# EAGLE design pulseoxintegr (EAGLE 6.5.0)
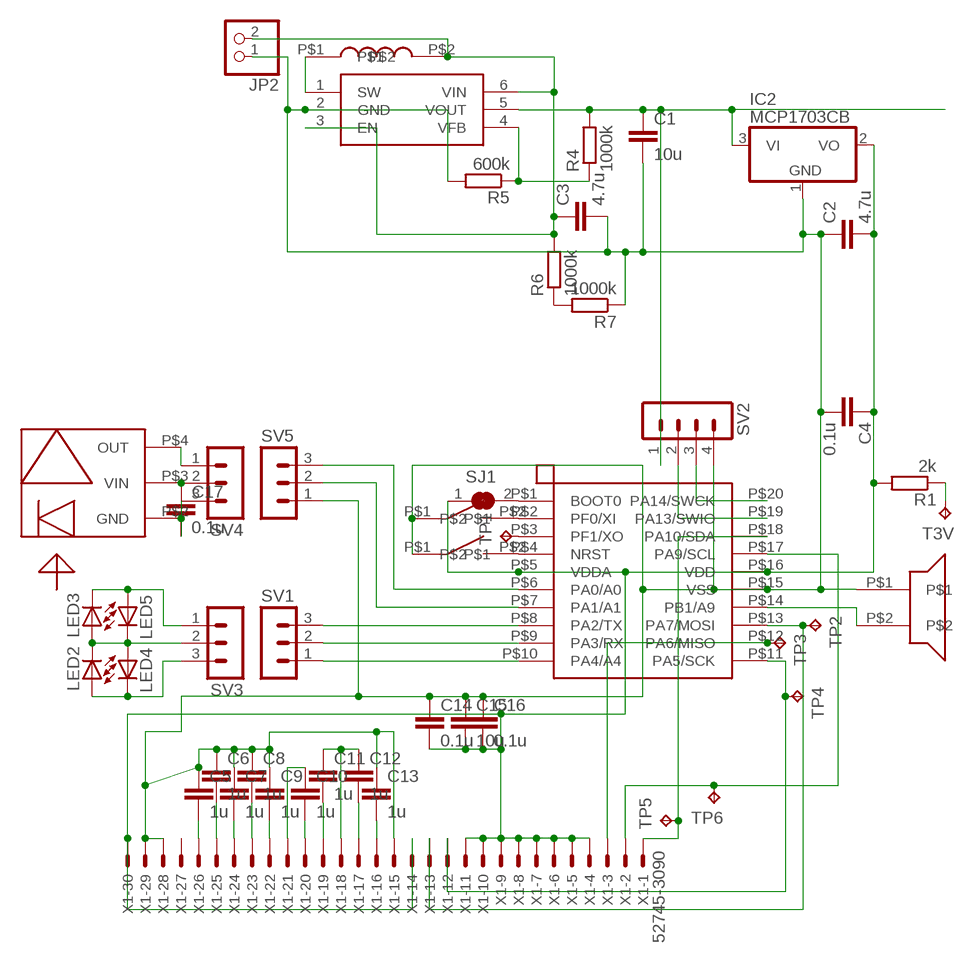
[diagram p0: schematic, sheet 1]

## Parts
C1  10u  C-EUC0603K  [C0603K]
C2  4.7u  C-EUC0603K  [C0603K]
C3  4.7u  C-EUC0603K  [C0603K]
C4  0.1u  C-EUC0603K  [C0603K]
C5  1u  C-EUC0603K  [C0603K]
C6  1u  C-EUC0603K  [C0603K]
C7  1u  C-EUC0603K  [C0603K]
C8  1u  C-EUC0603K  [C0603K]
C9  1u  C-EUC0603K  [C0603K]
C10  1u  C-EUC0603K  [C0603K]
C11  1u  C-EUC0603K  [C0603K]
C12  1u  C-EUC0603K  [C0603K]
C13  1u  C-EUC0603K  [C0603K]
C14  0.1u  C-EUC0603K  [C0603K]
C15  10u  C-EUC0603K  [C0603K]
C16  0.1u  C-EUC0603K  [C0603K]
C17  0.1u  C-EUC0603K  [C0603K]
IC2  MCP1703CB  [SOT23]
JP2  PINHD-1X2  [1X02]
LED2  LEDCHIP-LED0603  [CHIP-LED0603]
LED3  LEDCHIP-LED0603  [CHIP-LED0603]
LED4  LEDCHIP-LED0603  [CHIP-LED0603]
LED5  LEDCHIP-LED0603  [CHIP-LED0603]
R1  2k  R-EU_R0603  [R0603]
R4  1000k  R-EU_R0603  [R0603]
R5  600k  R-EU_R0603  [R0603]
R6  1000k  R-EU_R0603  [R0603]
R7  1000k  R-EU_R0603  [R0603]
SJ1  SJ  [SJ]
SV1  MA03-1  [MA03-1]
SV2  MA04-1  [MA04-1]
SV3  MA03-1  [MA03-1]
SV4  MA03-1  [MA03-1]
SV5  MA03-1  [MA03-1]
T3V  TPTP11R  [TP11R]
TP1  TPTP11R  [TP11R]
TP2  TPTP11R  [TP11R]
TP3  TPTP11R  [TP11R]
TP4  TPTP11R  [TP11R]
TP5  TPTP11R  [TP11R]
TP6  TPTP11R  [TP11R]
U$1  TSL12T  [TSL12T]
U$2  MCP1640SOT23-6  [SOT23-6L]
U$3  WE-TPC  [WE-TPC]
U$4  STM32F030F4P6  [TSSOP-20]
U$5  FSMSM  [FSMSM]
U$6  FSMSM  [FSMSM]
U$7  AT-2440-TWT-R  [AT-2440-TWT-R]
X1  52745-3090  [52745-3090]

## Nets
3V: C2.2 C4.1 C14.2 C15.2 C16.2 IC2.2(VO) R1.2 SJ1.1 U$4.P$5(VDDA) U$4.P$16(VDD) X1.4 X1.5 X1.6 X1.7 X1.8 X1.9 X1.10 X1.11 X1.14 X1.30
GND: C1.2 C2.1 C3.2 C4.2 C5.1 C6.1 C7.1 C8.1 C9.1 C13.1 C14.1 C15.1 C16.1 IC2.1(GND) JP2.1 R5.2 R7.1 SV2.4 SV5.1 U$2.2(GND) U$4.P$15(VSS) U$5.P$1 U$6.P$1 U$7.P$1 X1.15 X1.28 X1.29
N$1: SV5.3 U$4.P$6(PA0/A0)
N$2: SV5.2 U$4.P$7(PA1/A1)
N$3: U$4.P$14(PB1/A9) U$7.P$2
N$4: SV1.3 U$4.P$8(PA2/TX)
N$5: SV1.2 U$4.P$9(PA3/RX)
N$6: SV1.1 U$4.P$10(PA4/A4)
N$7: U$4.P$4(NRST) U$5.P$2
N$8: C1.1 IC2.3(VI) R4.2 SV2.1 U$2.5(VOUT)
N$9: U$2.1(SW) U$3.P$1
N$10: R4.1 R5.1 U$2.4(VFB)
N$11: C3.1 JP2.2 R6.2 U$2.3(EN) U$2.6(VIN) U$3.P$2
N$12: SV2.3 U$4.P$20(PA14/SWCK)
N$13: SV2.2 U$4.P$19(PA13/SWIO)
N$14: C17.1 SV4.2 U$1.P$3(VIN)
N$15: R6.1 R7.2
N$16: C17.2 SV4.3 U$1.P$2(GND)
N$17: SV4.1 U$1.P$4(OUT)
N$18: C5.2 X1.26
N$19: C6.2 X1.25
N$20: C7.2 X1.24
N$21: C8.2 X1.23
N$22: C9.2 X1.22
N$23: LED2.C LED3.A LED4.A LED5.C SV3.2
N$24: LED2.A LED4.C SV3.3
N$25: LED3.C LED5.A SV3.1
N$26: C10.2 X1.20
N$27: C12.2 X1.17
N$28: C11.2 X1.19
N$29: C13.2 X1.16
N$30: C11.1 C12.1 X1.18
N$31: C10.1 X1.21
N$32: TP6.TP U$4.P$17(PA9/SCL) X1.2
N$33: TP4.TP U$4.P$11(PA5/SCK) X1.12
N$34: TP2.TP U$4.P$13(PA7/MOSI) X1.13
N$35: TP3.TP U$4.P$12(PA6/MISO) X1.3
N$36: TP5.TP U$4.P$18(PA10/SDA) X1.1
N$37: U$4.P$2(PF0/XI) U$6.P$2
N$38: SJ1.2 U$4.P$1(BOOT0)
N$39: TP1.TP U$4.P$3(PF1/XO)
T3V: R1.1 T3V.TP
Unconnected: X1.27

## Library data of the parts
C1-C17 = rcl:C-EU: CAPACITOR, European symbol
IC2 = linear:MCP1703: 250 mA, 16V, Low Quiescent Current LDO Regulator Source: http://ww1.microchip.com/downloads/en/DeviceDoc/22049b.pdf
JP2 = pinhead:PINHD-1X2: PIN HEADER
LED2-LED5 = led:LED: LED OSRAM: - CHIPLED LG R971, LG N971, LY N971, LG Q971, LY Q971, LO R971, LY R971 LH N974, LH R974 LS Q976, LO Q976, LY Q976 LO Q996 - Hyper CHIPLED LW Q18S LB Q993, LB Q99A, LB R99A - SideLED LS A670, LO A670, LY A670, LG A670, LP A670 LB A673, LV A673, LT A673, LW A673 LH A674 LY A675 LS A676, LA A676, LO A676, LY A676, LW A676 LS A679, LY A679, LG A679 - Hyper Micro SIDELED® LS Y876, LA Y876, LO Y876, LY Y876 LT Y87S - SmartLED LW L88C, LW L88S LB L89C, LB L89S, LG L890 LS L89K, LO L89K, LY L89K LS L896, LA L896, LO L896, LY L896 - TOPLED LS T670, LO T670, LY T670, LG T670, LP T670 LSG T670, LSP T670, LSY T670, LOP T670, LYG T670 LG T671, LOG T671, LSG T671 LB T673, LV T673, LT T673, LW T673 LH T674 LS T676, LA T676, LO T676, LY T676, LB T676, LH T676, LSB T676, LW T676 LB T67C, LV T67C, LT T67C, LS T67K, LO T67K, LY T67K, LW E67C LS E67B, LA E67B, LO E67B, LY E67B, LB E67C, LV E67C, LT E67C LW T67C LS T679, LY T679, LG T679 LS T770, LO T770, LY T770, LG T770, LP T770 LB T773, LV T773, LT T773, LW T773 LH T774 LS E675, LA E675, LY E675, LS T675 LS T776, LA T776, LO T776, LY T776, LB T776 LHGB T686 LT T68C, LB T68C - Hyper Mini TOPLED® LB M676 - Mini TOPLED Santana® LG M470 LS M47K, LO M47K, LY M47K Source: http://www.osram.convergy.de LUXEON: - LUMILED® LXK2-PW12-R00, LXK2-PW12-S00, LXK2-PW14-U00, LXK2-PW14-V00 LXK2-PM12-R00, LXK2-PM12-S00, LXK2-PM14-U00 LXK2-PE12-Q00, LXK2-PE12-R00, LXK2-PE12-S00, LXK2-PE14-T00, LXK2-PE14-U00 LXK2-PB12-K00, LXK2-PB12-L00, LXK2-PB12-M00, LXK2-PB14-N00, LXK2-PB14-P00, LXK2-PB14-Q00 LXK2-PR12-L00, LXK2-PR12-M00, LXK2-PR14-Q00, LXK2-PR14-R00 LXK2-PD12-Q00, LXK2-PD12-R00, LXK2-PD12-S00 LXK2-PH12-R00, LXK2-PH12-S00 LXK2-PL12-P00, LXK2-PL12-Q00, LXK2-PL12-R00 Source: www.luxeon.com KINGBRIGHT: KA-3528ASYC Source: www.kingbright.com
R1 R4-R7 = rcl:R-EU_: RESISTOR, European symbol
SJ1 = jumper:SJ: SMD solder JUMPER
SV1 SV3-SV5 = con-lstb:MA03-1: PIN HEADER; OC_FARNELL: unknown; OC_NEWARK: unknown
SV2 = con-lstb:MA04-1: PIN HEADER; OC_FARNELL: unknown; OC_NEWARK: unknown
T3V TP1-TP6 = testpad:TP: Test pad
U$1 = pulseoxparts:TSL12T
U$2 = motiondet:MCP1640
U$3 = pulseoxparts:WE-TPC
U$4 = pulseoxparts:STM32F030F4P6
U$5 U$6 = untitled:FSMSM
U$7 = pulseoxparts:AT-2440-TWT-R
X1 = con-molex:52745-3090: FFC/FPC-to-Board 0.50mm (.020") SMT Top Contact Right Angle, ZIF, Style Receptacle 52745 / 52435 Source: http://www.molex.com/product/ffc/52745.html; OC_FARNELL: unknown; OC_NEWARK: unknown

## Board
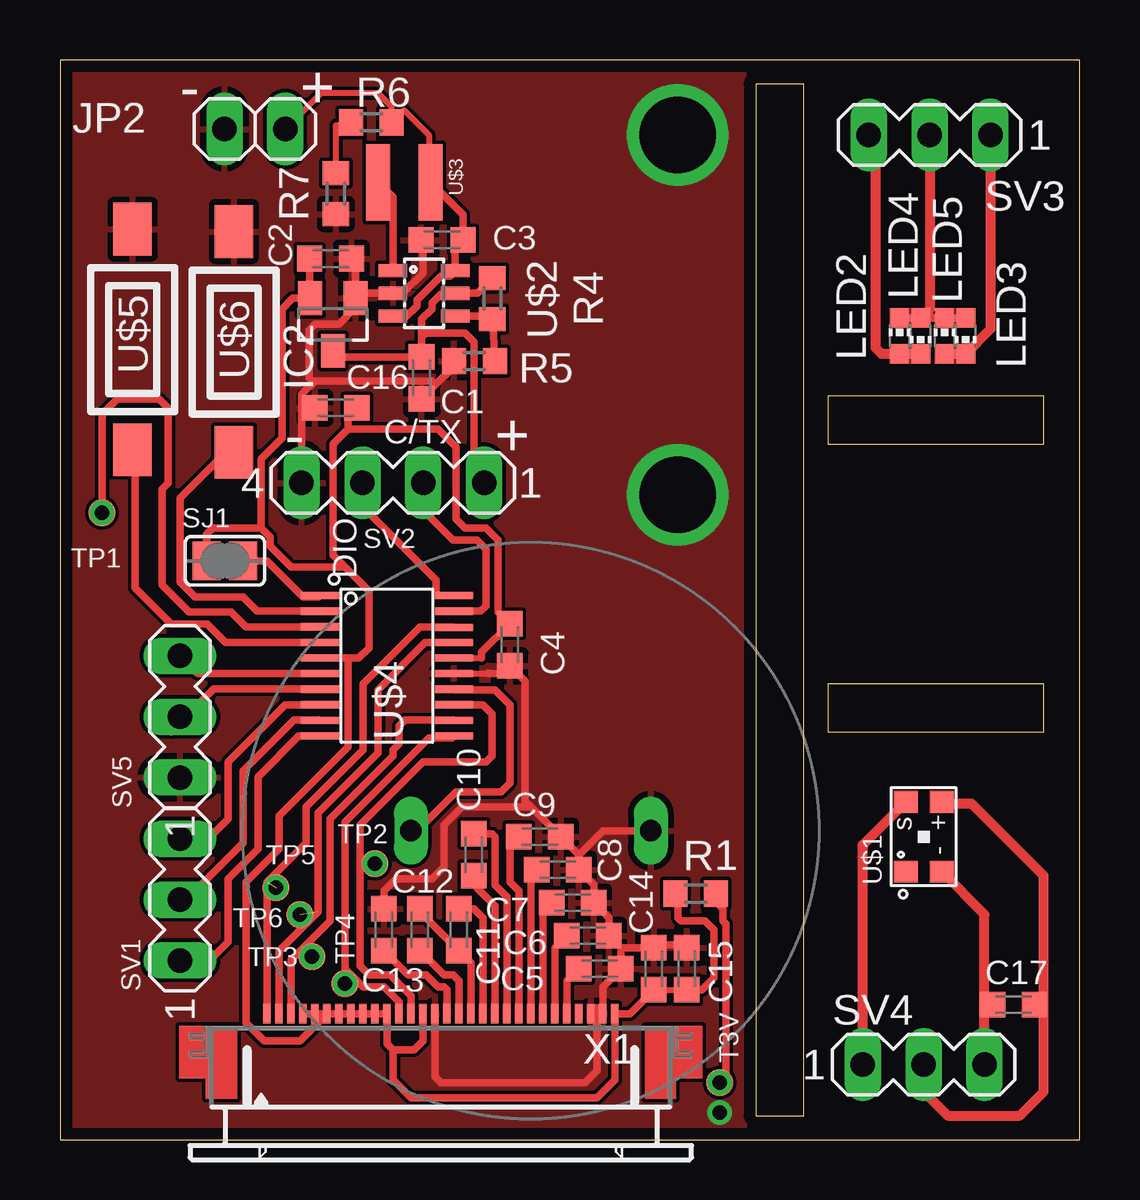
[diagram p1: board, top side]

Size 42.5 x 45 mm. Coordinates in mm from the lower left corner, seen from the top.
Outline: 0,0 42.5,0 42.5,45 0,45 0,0
Outline: 29,1 31,1 31,44 29,44 29,1
Outline: 32,19 32,17 41,17 41,19 32,19
Outline: 32,31 32,29 41,29 41,31 32,31
Copper layers (1*16): Top 0.035mm / dielectric 1.5mm / Bottom 0.035mm
Design rules "default *": minimum track width 10mil, minimum drill 0.5mm, track to track 6mil, track to pad 6mil, pad to pad 6mil, via to via 6mil, smd to smd 1mil, copper to edge 0.5mm, drill to drill 8mil, minimum pad ring 10mil, minimum via ring 8mil, stop-mask expansion 2mil, vias tented up to drill 0mil, thermal gap 10mil

### Footprints (pad centres in the part's own frame; a part is rotated, then mirrored left to right if it is on the bottom)
C0603K = smd 1.05 x 1.08: 1 -0.875,0; 2 0.875,0
SOT23 = smd 1 x 1.4: 1 -0.95,-1.1; 2 0.95,-1.1; 3 0,1.1
1X02 = drill 1.016 long: 1 -1.27,0; 2 1.27,0
CHIP-LED0603 = smd 0.8 x 0.8: A 0,-0.75; C 0,0.75
R0603 = smd 1 x 1.1: 1 -0.85,0; 2 0.85,0
SJ = smd 1.168 x 1.6: 1 -0.762,0; 2 0.762,0
MA03-1 = drill 1.016 long: 1 -2.54,0; 2 0,0; 3 2.54,0
MA04-1 = drill 1.016 long: 1 -3.81,0; 2 -1.27,0; 3 1.27,0; 4 3.81,0
TP11R = smd 1.1 x 1.1: TP 0,0
TSL12T = smd 0.9 x 1: P$1 -1.45,0.75; P$2 -1.45,-0.75; P$3 1.45,-0.75; P$4 1.45,0.75
SOT23-6L = smd 0.55 x 1.2: 1 -0.95,-1.3; 2 0,-1.3; 3 0.95,-1.3; 4 0.95,1.3; 5 0,1.3; 6 -0.95,1.3
WE-TPC = smd 3.2 x 1: P$1 0,-1.1; P$2 0,1.1
TSSOP-20 = smd 1.6 x 0.3: P$1 -2.8,2.925; P$2 -2.8,2.275; P$3 -2.8,1.625; P$4 -2.8,0.975; P$5 -2.8,0.325; P$6 -2.8,-0.325; P$7 -2.8,-0.975; P$8 -2.8,-1.625; P$9 -2.8,-2.275; P$10 -2.8,-2.925; P$11 2.8,-2.925; P$12 2.8,-2.275; P$13 2.8,-1.625; P$14 2.8,-0.975; P$15 2.8,-0.325; P$16 2.8,0.325; P$17 2.8,0.975; P$18 2.8,1.6; P$19 2.8,2.275; P$20 2.8,2.925
FSMSM = smd 2.2 x 1.6: P$1 -4.6,0; P$2 4.6,0
AT-2440-TWT-R = drill 0.9 long: P$1 -5,0; P$2 5,0
52745-3090 = smd 0.3 x 0.8: 1 -7.25,2.5; 2 -6.75,2.5; 3 -6.25,2.5; 4 -5.75,2.5; 5 -5.25,2.5; 6 -4.75,2.5; 7 -4.25,2.5; 8 -3.75,2.5; 9 -3.25,2.5; 10 -2.75,2.5; 11 -2.25,2.5; 12 -1.75,2.5; 13 -1.25,2.5; 14 -0.75,2.5; 15 -0.25,2.5; 16 0.25,2.5; 17 0.75,2.5; 18 1.25,2.5; 19 1.75,2.5; 20 2.25,2.5; 21 2.75,2.5; 22 3.25,2.5; 23 3.75,2.5; 24 4.25,2.5; 25 4.75,2.5; 26 5.25,2.5; 27 5.75,2.5; 28 6.25,2.5; 29 6.75,2.5; 30 7.25,2.5

### Placement (x,y rotation side)
C1  15.07,31.75 270 top
C2  11.28,36.73 180 top
C3  15.93,37.5 180 top
C4  18.75,20.62 270 top
C5  22.5,7.12 180 top
C6  22,8.5 180 top
C7  21.38,9.88 180 top
C8  20.75,11.25 180 top
C9  20,12.62 180 top
C10  17.25,11.88 270 top
C11  16.62,8.75 90 top
C12  15,8.75 270 top
C13  13.5,8.75 270 top
C14  24.75,7.12 270 top
C15  26.12,7.12 270 top
C16  11.5,30.5 0 top
C17  39.75,5.62 180 top
IC2  11.38,33.98 180 top
JP2  8.12,42.12 0 top
LED2  35,33.5 0 top
LED3  37.75,33.5 180 top
LED4  35.88,33.5 180 top
LED5  36.88,33.5 0 top
R1  26.5,10.25 180 top
R4  18.02,35.05 90 top
R5  17.27,32.45 180 top
R6  12.97,42.4 0 top
R7  11.5,39.42 90 top
SJ1  6.88,24.12 0 top
SV1  5,10 90 top
SV2  13.88,27.38 180 top
SV3  36.25,41.88 180 top
SV4  36,3.12 0 top
SV5  5,17.62 90 top
T3V  27.5,2.38 0 top
TP1  1.75,26.12 0 top
TP2  13.12,11.5 0 top
TP3  10.5,7.62 0 top
TP4  11.88,6.5 0 top
TP5  9,10.5 0 top
TP6  10,9.38 0 top
U$1  36,12.62 90 top
U$2  15.18,35.27 270 top
U$3  14.35,39.9 270 top
U$4  13.62,19.75 0 top
U$5  3.02,33.35 270 top
U$6  7.25,33.25 270 top
U$7  19.62,12.88 180 top
X1  15.88,2.75 0 top

### Tracks (layer width: path | path; a pad name or v marks a point on that pad's centre or on a via)
3V
  Top 0.254: U$4.P$16 17.57,20.07 | C14.2 25.75,6.25
  Top 0.305: C2.2 10.4,35.1 IC2.2 9.7,35.08 9.25,34.62 9.25,29.25 8.38,28.38 8.38,25.5 | X1.6 X1.5 X1.4 | X1.6 X1.7 X1.8 X1.9 X1.10 X1.11 13.62,4 13.88,3.75 | 13.88,3.75 14.75,3.75 15.12,4.12 X1.14 | 13.88,3.75 13.88,2.5 14.62,1.75 22.38,1.75 23.12,2.5 X1.30 23.75,5.25 C14.2 | 12.12,20.07 U$4.P$5 11.93,20.07 | 12.12,20.07 12.45,20.07 12.88,20.5 12.88,22.88 11.88,23.88 | 11.88,23.88 11.38,24.38 11.38,29 12,29.62 | 12,29.62 15.75,29.62 16.5,28.88 16.5,25.88 16.88,25.5 17.75,25.5 18.25,25 18.25,22 C4.1 17.57,20.32 17.57,20.07 | X1.6 10,4.12 8.5,4.12 7.75,4.88 7.75,10.75 9.12,12.12 9.12,13.5 12,16.38 12,19.95 12.12,20.07 | 25.75,6.25 C15.2 26.75,6.25 27.25,6.75 27.25,8.75 26.88,9.12 25.88,9.12 25.75,9.25 25.75,10.15 R1.2 | SJ1.1 6.11,25.24 6.38,25.5 8.38,25.5 | 8.38,25.5 8.75,25.12 8.75,24.75 9.62,23.88 11.88,23.88 | 12,29.62 12,30.12 C16.2
GND  (via drill 0.6, 3.2)
  Top 0.254: U$4.P$15 17.82,19.43
  Top 0.305: C3.2 15.12,37.42 15.12,36.12 14.28,35.27 U$2.2 12.53,35.27 IC2.1 | IC2.1 12.32,36.55 C2.1 | R5.2 16.32,32.12 15.66,31.46 | 15.66,31.46 C1.2 | 10.62,31.62 15.5,31.62 15.66,31.46 | 10.62,31.62 10.5,31.62 10.38,31.75 10.38,33.75 10.62,34 11.62,34 12.32,34.7 IC2.1 | SV2.4 10.06,30.62 | 10.06,30.62 10.06,31.07 10.62,31.62 | X1.29 X1.28 | X1.15 15.62,2.62 15.88,2.38 21.88,2.38 22.38,2.88 22.38,5 X1.28 | X1.28 22.12,5.5 22.5,5.5 22.62,5.62 22.62,6.38 C5.1 23.38,8 | 23.38,8 C6.1 22.88,9.25 C7.1 22.25,10.62 C8.1 21.62,11.88 | 21.62,11.88 C9.1 19.62,13.88 | C13.1 13.5,10.38 14,10.88 15.5,10.88 16,11.38 16,13.12 16.75,13.88 19.62,13.88 | 17.82,19.43 18.43,19.43 | 18.43,19.43 C4.2 18.62,19.62 | C15.1 25.88,8.25 25.75,8.12 24.88,8.12 C14.1 23.38,8 | U$7.P$1 22.62,12.88 21.62,11.88 | 18.43,19.43 19.07,19.43 19.38,19.12 19.38,14.12 19.62,13.88 | C16.1 10.19,30.5 10.06,30.62
  other vias: 27.5,1.12 25.75,41.88 25.75,26.88
  pour Top: 0.12,45 29.5,45 29.5,-2.88 -3.62,-2.88 -3.62,43.75
N$1
  Top 0.305: U$4.P$6 5.74,19.43 SV5.3
N$2
  Top 0.305: U$4.P$7 6.4,18.77 4.62,17 4.62,17.25 SV5.2
N$3
  Top 0.305: U$7.P$2 14.88,12.88 16.5,14.5 18.38,14.5 18.75,14.88 18.75,18.12 18.12,18.75 16.45,18.75 U$4.P$14
N$4
  Top 0.305: U$4.P$8 9.38,18.12 7,15.75 7,13.38 6.12,12.5 5.04,12.5 SV1.3
N$5
  Top 0.305: SV1.2 5.25,10 7.62,12.38 7.62,15.38 9.75,17.5 10.8,17.5 U$4.P$9
N$6
  Top 0.305: SV1.1 5.04,7.5 6.25,7.5 7,8.25 7,10.88 8.25,12.12 8.25,15.12 9.95,16.82 U$4.P$10
N$7
  Top 0.305: U$4.P$4 6.9,20.73 6.12,21.5 4.62,21.5 3.12,23 3.12,28.65 U$5.P$2
N$8
  Top 0.305: C1.1 11.62,32.62 IC2.3 | C1.1 15.07,34.2 15.5,34.62 15.5,34.88 15.88,35.25 16.45,35.25 U$2.5 17.4,35.27 R4.2 | C1.1 15.07,33.45 15.25,33.62 16.88,33.62 17.25,33.25 17.25,27.81 SV2.1
N$9
  Top 0.305: U$2.1 13.88,39.27 U$3.P$1
N$10
  Top 0.305: U$2.4 17.9,34.33 R4.1 R5.1
N$11
  Top 0.254: 15.8,39.55 15.38,39.98 15.38,41.88 14.35,42.9 R6.2 13.82,43.05 13.25,43.62 10.89,43.62 JP2.2
  Top 0.305: U$2.3 14.45,34.33 14.88,34.75 14.88,35 15.88,36 16.25,36 U$2.6 16.48,37.17 C3.1 16.8,38.55 15.8,39.55 U$3.P$2
N$12
  Top 0.305: U$4.P$20 15.68,22.68 15.68,23.32 12.62,26.38 12.62,27.36 SV2.3
N$13
  Top 0.305: U$4.P$19 17.52,22.02 17.75,22.25 17.75,24.62 17.38,25 16.38,25 15.38,26 15.38,26.62 15.12,26.88 15.12,27.36 SV2.2
N$14
  Top 0.254: C17.1 40.88,5.62 41,5.5
  Top 0.406: SV4.2 36,2 37,1 40,1 41,2 41,5.5 41,11 38,14 36.83,14 U$1.P$3
N$15
  Top 0.254: R7.2 11.5,42.27 R6.1
N$16
  Top 0.254: C17.2 38.66,5.62 38.54,5.5
  Top 0.406: SV4.3 38.54,5.5 38.54,9.38 U$1.P$2
N$17
  Top 0.406: SV4.1 33.46,12.29 U$1.P$4
N$18
  Top 0.305: X1.26 21.12,6.62 C5.2
N$19
  Top 0.305: X1.25 20.62,8 C6.2
N$20
  Top 0.305: X1.24 20.12,9.5 C7.2
N$21
  Top 0.305: X1.23 19.62,11 C8.2
N$22
  Top 0.305: X1.22 19.12,10.38 18.75,10.75 18.75,12.25 C9.2
N$23
  Top 0.305: LED3.A LED5.C 36.38,34.25 | 36.38,34.25 LED4.A LED2.C | 36.25,34.38 36.38,34.25
  Top 0.406: SV3.2 36.25,34.62 LED4.A
N$24
  Top 0.406: LED4.C LED2.A 34.25,32.75 34,33 34,41.59 SV3.3
N$25
  Top 0.406: SV3.1 38.79,33.79 LED3.C LED5.A
N$26
  Top 0.305: X1.20 18.12,9.75 17.38,10.5 17.38,10.88 C10.2
N$27
  Top 0.305: X1.17 16.62,6.62 16.38,6.88 16,6.88 C12.2
N$28
  Top 0.305: X1.19 17.62,9.25 17.25,9.62 C11.2
N$29
  Top 0.305: X1.16 16.12,6.25 16,6.38 15.75,6.38 15.25,6.88 14.5,6.88 C13.2
N$30
  Top 0.305: X1.18 17.12,7.38 C11.1 15,9.5 C12.1
N$31
  Top 0.305: C10.1 18,12.75 18.12,12.62 18.12,10.62 18.62,10.12 X1.21
N$32  (via drill 0.6)  (1 unrouted)
  Top 0.305: X1.2 9.12,7.88 10.75,9.5 10.75,13.62 13.25,16.12 13.25,18.75 15.22,20.73 U$4.P$17
  other vias: 10,9.38
N$33  (via drill 0.6)
  Top 0.254: 11.88,7.12 TP4.TP
  Top 0.305: X1.12 14.12,5.75 13.5,6.38 12.62,6.38 11.88,7.12 11.88,13.25 15.38,16.75 16.35,16.75 U$4.P$11
  other vias: 11.88,6.5
N$34  (via drill 0.6)
  Top 0.305: X1.13 14.62,6 13.75,6.88 12.88,6.88 12.5,7.25 12.5,11.75 | 12.5,11.75 12.5,13.12 15.12,15.75 17.75,15.75 18,16 18,17.75 17.62,18.12 U$4.P$13 | TP2.TP 12.75,11.5 12.5,11.75
  other vias: 13.12,11.5
N$35  (via drill 0.6)
  Top 0.254: 16.4,17.5 U$4.P$12
  Top 0.305: X1.3 9.62,7.5 9.94,7.81 | 9.94,7.81 11.25,9.12 11.25,13.38 13.88,16 13.88,16.25 14.12,16.5 14.12,17.25 14.38,17.5 16.4,17.5 | TP3.TP 10.12,7.62 9.94,7.81
  other vias: 10.5,7.62
N$36  (via drill 0.6)  (1 unrouted)
  Top 0.305: X1.1 8.62,10.75 10.25,12.38 10.25,13.88 12.62,16.25 12.62,19 15,21.38 16.4,21.38 U$4.P$18
  other vias: 9,10.5
N$37
  Top 0.305: U$4.P$2 8.22,22.02 7.62,22.62 5.62,22.62 5,23.25 5,26.75 6.62,28.38 6.97,28.38 U$6.P$2
N$38
  Top 0.305: SJ1.2 8.62,24.12 10.12,22.62 10.78,22.62 U$4.P$1
N$39  (via drill 0.6)
  Top 0.305: U$4.P$3 7.75,21.38 7.12,22 5.38,22 4.25,23.12 4.25,27.12 4.5,27.38 4.5,30.5 4.12,30.88 2.38,30.88 1.75,30.25 TP1.TP
  other vias: 1.75,26.12
T3V  (via drill 0.6)
  Top 0.305: R1.1 27.35,9.9 27.62,9.62 27.62,9.12 27.75,9 27.75,2.62 T3V.TP
  other vias: 27.5,2.38

### Text on the board
tPlace: - | + | C/TX | - | + | DIO